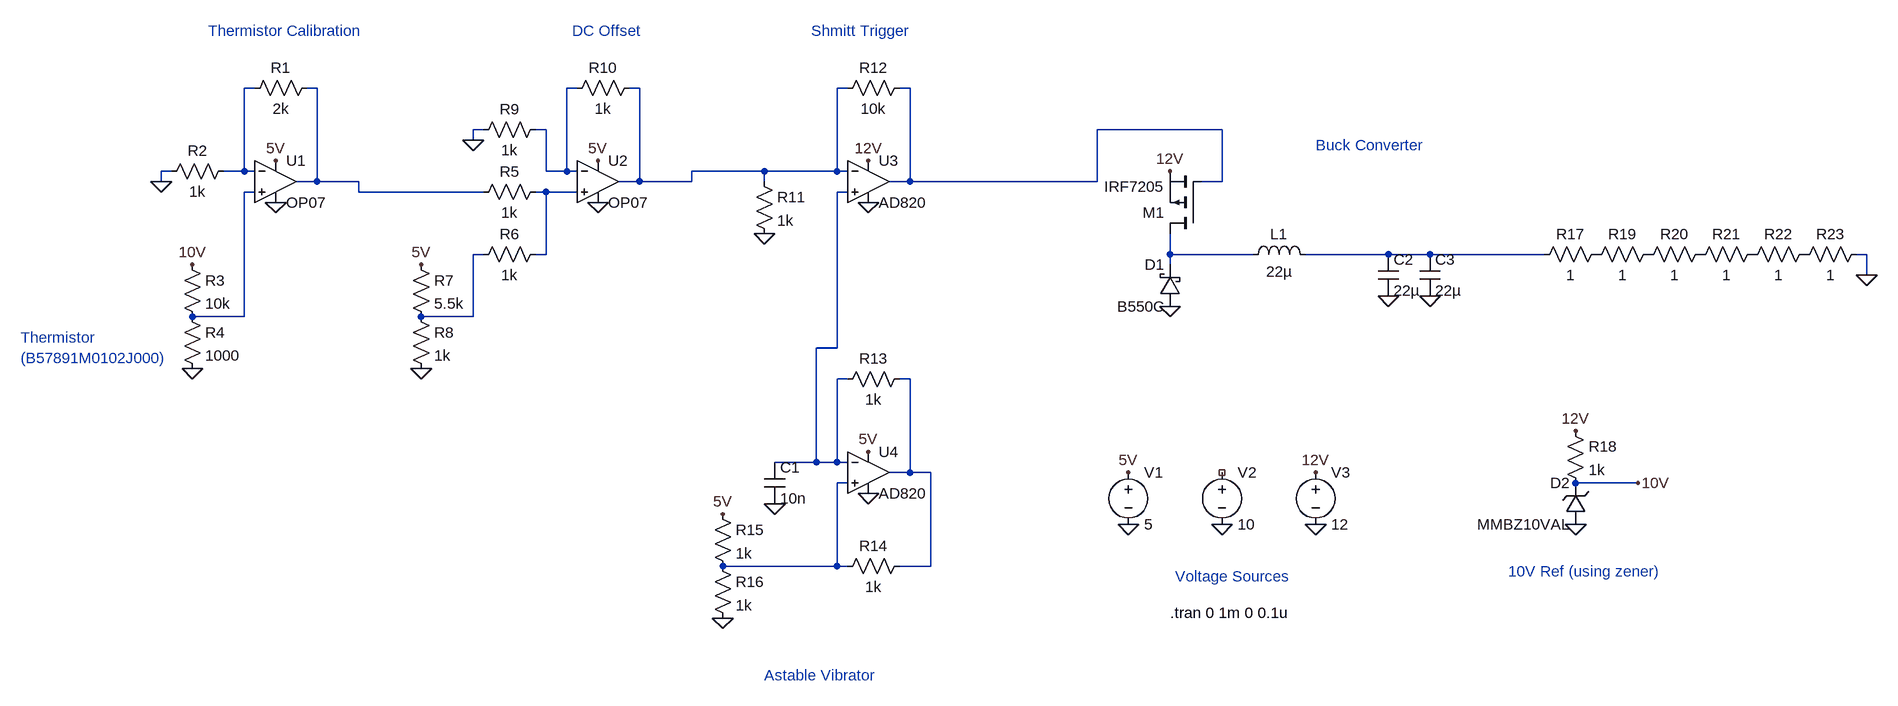
[diagram p0: schematic beverageWarmerSim2.asc]
beverageWarmerSim2.asc, the LTspice schematic file:
Version 4
SHEET 1 2532 840
WIRE 32 -80 16 -80
WIRE 128 -80 112 -80
WIRE 528 -80 512 -80
WIRE 624 -80 608 -80
WIRE 944 -80 928 -80
WIRE 1040 -80 1024 -80
WIRE 384 -16 368 -16
WIRE 480 -16 464 -16
WIRE 1520 -16 1328 -16
WIRE 368 0 368 -16
WIRE -96 48 -112 48
WIRE 16 48 16 -80
WIRE 16 48 -16 48
WIRE 32 48 16 48
WIRE 480 48 480 -16
WIRE 512 48 512 -80
WIRE 512 48 480 48
WIRE 528 48 512 48
WIRE 816 48 704 48
WIRE 928 48 928 -80
WIRE 928 48 816 48
WIRE 944 48 928 48
WIRE -112 64 -112 48
WIRE 128 64 128 -80
WIRE 128 64 96 64
WIRE 192 64 128 64
WIRE 624 64 624 -80
WIRE 624 64 592 64
WIRE 704 64 704 48
WIRE 704 64 624 64
WIRE 816 64 816 48
WIRE 1040 64 1040 -80
WIRE 1040 64 1008 64
WIRE 1328 64 1328 -16
WIRE 1328 64 1040 64
WIRE 1520 64 1520 -16
WIRE 1520 64 1488 64
WIRE 32 80 16 80
WIRE 192 80 192 64
WIRE 384 80 192 80
WIRE 480 80 464 80
WIRE 528 80 480 80
WIRE 944 80 928 80
WIRE 384 176 368 176
WIRE 480 176 480 80
WIRE 480 176 464 176
WIRE 1440 176 1440 144
WIRE 1568 176 1440 176
WIRE 1776 176 1648 176
WIRE 1840 176 1776 176
WIRE 2016 176 1840 176
WIRE 2512 176 2496 176
WIRE 1440 192 1440 176
WIRE 2512 208 2512 176
WIRE 16 272 16 80
WIRE 16 272 -64 272
WIRE 368 272 368 176
WIRE 368 272 288 272
WIRE 928 320 928 80
WIRE 928 320 896 320
WIRE 944 368 928 368
WIRE 1040 368 1024 368
WIRE 896 496 896 320
WIRE 896 496 832 496
WIRE 928 496 928 368
WIRE 928 496 896 496
WIRE 944 496 928 496
WIRE 1040 512 1040 368
WIRE 1040 512 1008 512
WIRE 1072 512 1040 512
WIRE 944 528 928 528
WIRE 2160 528 2064 528
WIRE 928 656 928 528
WIRE 928 656 752 656
WIRE 944 656 928 656
WIRE 1072 656 1072 512
WIRE 1072 656 1024 656
FLAG 64 96 0
FLAG -112 64 0
FLAG -64 192 10V
FLAG 64 32 5V
FLAG -64 352 0
FLAG 288 192 5V
FLAG 288 352 0
FLAG 560 96 0
FLAG 368 0 0
FLAG 560 32 5V
FLAG 816 144 0
FLAG 976 32 12V
FLAG 976 96 0
FLAG 976 480 5V
FLAG 976 544 0
FLAG 832 560 0
FLAG 752 576 5V
FLAG 752 736 0
FLAG 1440 48 12V
FLAG 1440 256 0
FLAG 1776 240 0
FLAG 1840 240 0
FLAG 1376 592 0
FLAG 1376 512 5V
FLAG 1520 592 0
FLAG 1664 592 0
FLAG 1664 512 12V
FLAG 2064 592 0
FLAG 2064 448 12V
FLAG 2160 528 10V
FLAG 2512 208 0
SYMBOL OpAmps\\OP07 64 0 R0
SYMATTR InstName U1
SYMBOL OpAmps\\OP07 560 0 R0
SYMATTR InstName U2
SYMBOL res 128 -96 R90
WINDOW 0 0 56 VBottom 2
WINDOW 3 32 56 VTop 2
SYMATTR InstName R1
SYMATTR Value 2k
SYMBOL res 0 32 R90
WINDOW 0 0 56 VBottom 2
WINDOW 3 32 56 VTop 2
SYMATTR InstName R2
SYMATTR Value 1k
SYMBOL res -80 176 R0
SYMATTR InstName R3
SYMATTR Value 10k
SYMBOL res -80 256 R0
SYMATTR InstName R4
SYMATTR Value 1000
SYMBOL res 480 64 R90
WINDOW 0 0 56 VBottom 2
WINDOW 3 32 56 VTop 2
SYMATTR InstName R5
SYMATTR Value 1k
SYMBOL res 480 160 R90
WINDOW 0 0 56 VBottom 2
WINDOW 3 32 56 VTop 2
SYMATTR InstName R6
SYMATTR Value 1k
SYMBOL res 272 176 R0
SYMATTR InstName R7
SYMATTR Value 5.5k
SYMBOL res 272 256 R0
SYMATTR InstName R8
SYMATTR Value 1k
SYMBOL res 480 -32 R90
WINDOW 0 0 56 VBottom 2
WINDOW 3 32 56 VTop 2
SYMATTR InstName R9
SYMATTR Value 1k
SYMBOL res 624 -96 R90
WINDOW 0 0 56 VBottom 2
WINDOW 3 32 56 VTop 2
SYMATTR InstName R10
SYMATTR Value 1k
SYMBOL OpAmps\\AD820 976 0 R0
SYMATTR InstName U3
SYMBOL res 800 48 R0
SYMATTR InstName R11
SYMATTR Value 1k
SYMBOL res 1040 -96 R90
WINDOW 0 0 56 VBottom 2
WINDOW 3 32 56 VTop 2
SYMATTR InstName R12
SYMATTR Value 10k
SYMBOL OpAmps\\AD820 976 448 R0
SYMATTR InstName U4
SYMBOL res 1040 352 R90
WINDOW 0 0 56 VBottom 2
WINDOW 3 32 56 VTop 2
SYMATTR InstName R13
SYMATTR Value 1k
SYMBOL cap 816 496 R0
SYMATTR InstName C1
SYMATTR Value 10n
SYMBOL res 1040 640 R90
WINDOW 0 0 56 VBottom 2
WINDOW 3 32 56 VTop 2
SYMATTR InstName R14
SYMATTR Value 1k
SYMBOL res 736 560 R0
SYMATTR InstName R15
SYMATTR Value 1k
SYMBOL res 736 640 R0
SYMATTR InstName R16
SYMATTR Value 1k
SYMBOL pmos 1488 144 R180
SYMATTR InstName M1
SYMATTR Value IRF7205
SYMBOL schottky 1456 256 R180
WINDOW 0 24 64 Left 2
WINDOW 3 24 0 Left 2
SYMATTR InstName D1
SYMATTR Value B550C
SYMATTR Description Diode
SYMATTR Type diode
SYMBOL ind 1552 192 R270
WINDOW 0 32 56 VTop 2
WINDOW 3 5 56 VBottom 2
SYMATTR InstName L1
SYMATTR Value 22µ
SYMBOL cap 1760 176 R0
SYMATTR InstName C2
SYMATTR Value 22µ
SYMBOL cap 1824 176 R0
SYMATTR InstName C3
SYMATTR Value 22µ
SYMBOL voltage 1376 496 R0
WINDOW 123 0 0 Left 0
WINDOW 39 0 0 Left 0
SYMATTR InstName V1
SYMATTR Value 5
SYMBOL voltage 1520 496 R0
WINDOW 123 0 0 Left 0
WINDOW 39 0 0 Left 0
SYMATTR InstName V2
SYMATTR Value 10
SYMBOL voltage 1664 496 R0
WINDOW 123 0 0 Left 0
WINDOW 39 0 0 Left 0
SYMATTR InstName V3
SYMATTR Value 12
SYMBOL zener 2080 592 R180
WINDOW 0 24 64 Left 2
WINDOW 3 24 0 Left 2
SYMATTR InstName D2
SYMATTR Value MMBZ10VAL
SYMATTR Description Diode
SYMATTR Type diode
SYMBOL res 2048 432 R0
SYMATTR InstName R18
SYMATTR Value 1k
SYMBOL res 2112 160 R90
WINDOW 0 0 56 VBottom 2
WINDOW 3 32 56 VTop 2
SYMATTR InstName R17
SYMATTR Value 1
SYMBOL res 2192 160 R90
WINDOW 0 0 56 VBottom 2
WINDOW 3 32 56 VTop 2
SYMATTR InstName R19
SYMATTR Value 1
SYMBOL res 2272 160 R90
WINDOW 0 0 56 VBottom 2
WINDOW 3 32 56 VTop 2
SYMATTR InstName R20
SYMATTR Value 1
SYMBOL res 2352 160 R90
WINDOW 0 0 56 VBottom 2
WINDOW 3 32 56 VTop 2
SYMATTR InstName R21
SYMATTR Value 1
SYMBOL res 2432 160 R90
WINDOW 0 0 56 VBottom 2
WINDOW 3 32 56 VTop 2
SYMATTR InstName R22
SYMATTR Value 1
SYMBOL res 2512 160 R90
WINDOW 0 0 56 VBottom 2
WINDOW 3 32 56 VTop 2
SYMATTR InstName R23
SYMATTR Value 1
TEXT 1440 728 Left 2 !.tran 0 1m 0 0.1u
TEXT 1960 664 Left 2 ;10V Ref (using zener)
TEXT 1448 672 Left 2 ;Voltage Sources
TEXT 816 824 Left 2 ;Astable Vibrator
TEXT 888 -168 Left 2 ;Shmitt Trigger
TEXT 520 -168 Left 2 ;DC Offset
TEXT -40 -168 Left 2 ;Thermistor Calibration
TEXT 1664 8 Left 2 ;Buck Converter
TEXT -328 304 Left 2 ;Thermistor\n(B57891M0102J000)

The netlist it stands for:
* beverageWarmerSim2.asc
XU1 N006 N001 5V 0 N002 LT1001  ; OP07, pins In+ In- V+ V- OUT
XU2 N007 N003 5V 0 N004 LT1001  ; OP07, pins In+ In- V+ V- OUT
R1 N002 N001 2k
R2 N001 0 1k
R3 10V N006 10k
R4 N006 0 1000
R5 N007 N002 1k
R6 N007 N009 1k
R7 5V N009 5.5k
R8 N009 0 1k
R9 N003 0 1k
R10 N004 N003 1k
XU3 N008 N004 12V 0 N005 AD820  ; pins In+ In- V+ V- OUT
R11 N004 0 1k
R12 N005 N004 10k
XU4 N013 N008 5V 0 N012 AD820  ; pins In+ In- V+ V- OUT
R13 N012 N008 1k
C1 N008 0 10n
R14 N012 N013 1k
R15 5V N013 1k
R16 N013 0 1k
M1 N010 N005 12V 12V IRF7205
D1 0 N010 B550C
L1 N010 N011 22µ
C2 N011 0 22µ
C3 N011 0 22µ
V1 5V 0 5
V2 NC_01 0 10
V3 12V 0 12
D2 0 10V MMBZ10VAL
R18 12V 10V 1k
R17 P001 N011 1
R19 P002 P001 1
R20 P003 P002 1
R21 P004 P003 1
R22 P005 P004 1
R23 0 P005 1
.model D D
.lib standard.dio
.model NMOS NMOS
.model PMOS PMOS
.lib standard.mos
.tran 0 1m 0 0.1u
* 10V Ref (using zener)
* Voltage Sources
* Astable Vibrator
* Shmitt Trigger
* DC Offset
* Thermistor Calibration
* Buck Converter
* Thermistor
* (B57891M0102J000)
.lib LTC.lib
.backanno
.end